# Altium project RPI GPIO BOARD.PrjPcb
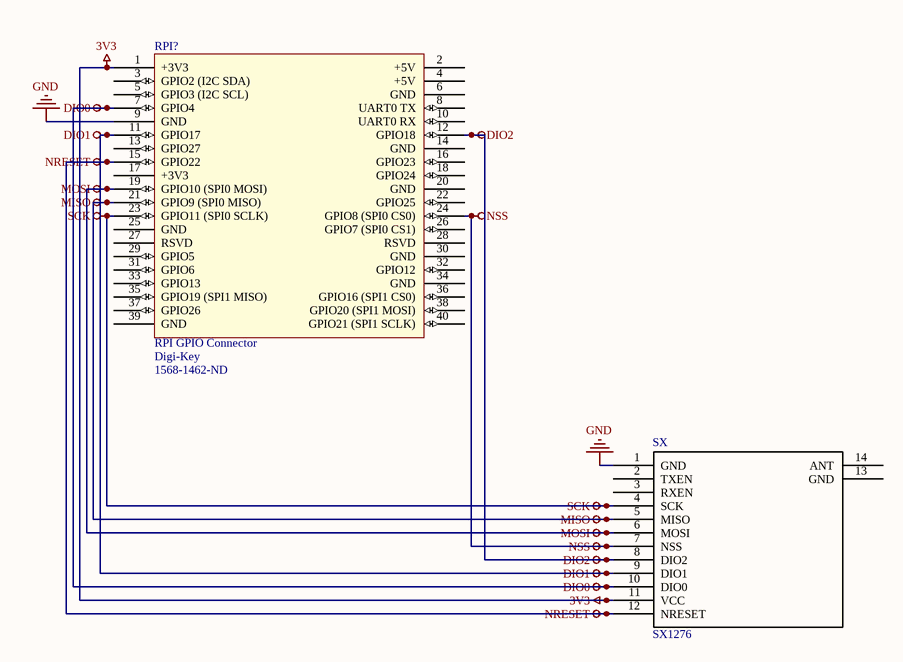
[diagram p0: RPI 3.SchDoc]
mProjectAuthor: Nils Minor; mProjectName: RPI BOARD; mProjectRevision: 0; mProjectVersion: 1
1 sheet, 2 parts. Net scope: global (net labels, ports and power ports of the same name join across sheets).
Board files: RPI 3.PcbDoc, PCB1.PcbDoc

## Sheet RPI 3.SchDoc
size A4; SheetNumber: 1; SheetTotal: 1

### Parts
RPI?  RPI GPIO Connector  Supplier 1: Digi-Key  Supplier Part Number 1: 1568-1462-ND  [rpi]
SX  SX1276  [PCBComponent_1]

### Nets
3V3: RPI?.1(+3V3) SX.11(VCC)
DIO0: RPI?.7(GPIO4) SX.10(DIO0)
DIO1: RPI?.11(GPIO17) SX.9(DIO1)
DIO2: RPI?.12(GPIO18) SX.8(DIO2)
GND: RPI?.9(GND) SX.1(GND)
MISO: RPI?.21(GPIO9_(SPI0_MISO)) SX.5(MISO)
MOSI: RPI?.19(GPIO10_(SPI0_MOSI)) SX.6(MOSI)
NRESET: RPI?.15(GPIO22) SX.12(NRESET)
NSS: RPI?.24(GPIO8_(SPI0_CS0)) SX.7(NSS)
SCK: RPI?.23(GPIO11_(SPI0_SCLK)) SX.4(SCK)

Not connected (* = marked no-connect by the designer): RPI? 2(+5V) 3(GPIO2_(I2C_SDA)) 4(+5V) 5(GPIO3_(I2C_SCL)) 6(GND) 8(UART0_TX) 10(UART0_RX) 13(GPIO27) 14(GND) 16(GPIO23) 17(+3V3) 18(GPIO24) 20(GND) 22(GPIO25) 25(GND) 26(GPIO7_(SPI0_CS1)) 27(RSVD) 28(RSVD) 29(GPIO5) 30(GND) 31(GPIO6) 32(GPIO12) 33(GPIO13) 34(GND) 35(GPIO19_(SPI1_MISO)) 36(GPIO16_(SPI1_CS0)) 37(GPIO26) 38(GPIO20_(SPI1_MOSI)) 39(GND) 40(GPIO21_(SPI1_SCLK)); SX 2(TXEN) 3(RXEN) 13(GND) 14(ANT)

### Library data of the parts
RPI? = rpi connector: GPIO Header for Raspberry Pi A+/B+/Pi 2/Pi 3 - 2x20; Manufacturer: SparkFun Electronics; Manufacturer Part Number: PRT-14017; Nils Minor: author; nilsminor@web.de: mail; RoHS: RoHS Compliant; Category: Development Boards, Kits, Programmers; Stock 1: 150; Pricing 1: 1=1.84 (EUR); Part Status: Active; Accessory Type: Connector; For Use With/Related Products: Raspberry Pi; ComponentLink1URL: https://cdn.sparkfun.com/datasheets/Dev/RaspberryPi/12313.pdf; ComponentLink1Description: https://cdn.sparkfun.com/datasheets/Dev/RaspberryPi/12313.pdf
SX = Lora1276: G-NICERF 1276

## Assembly variants
default: all parts fitted